# Altium project Strain gauge node.PrjPcb
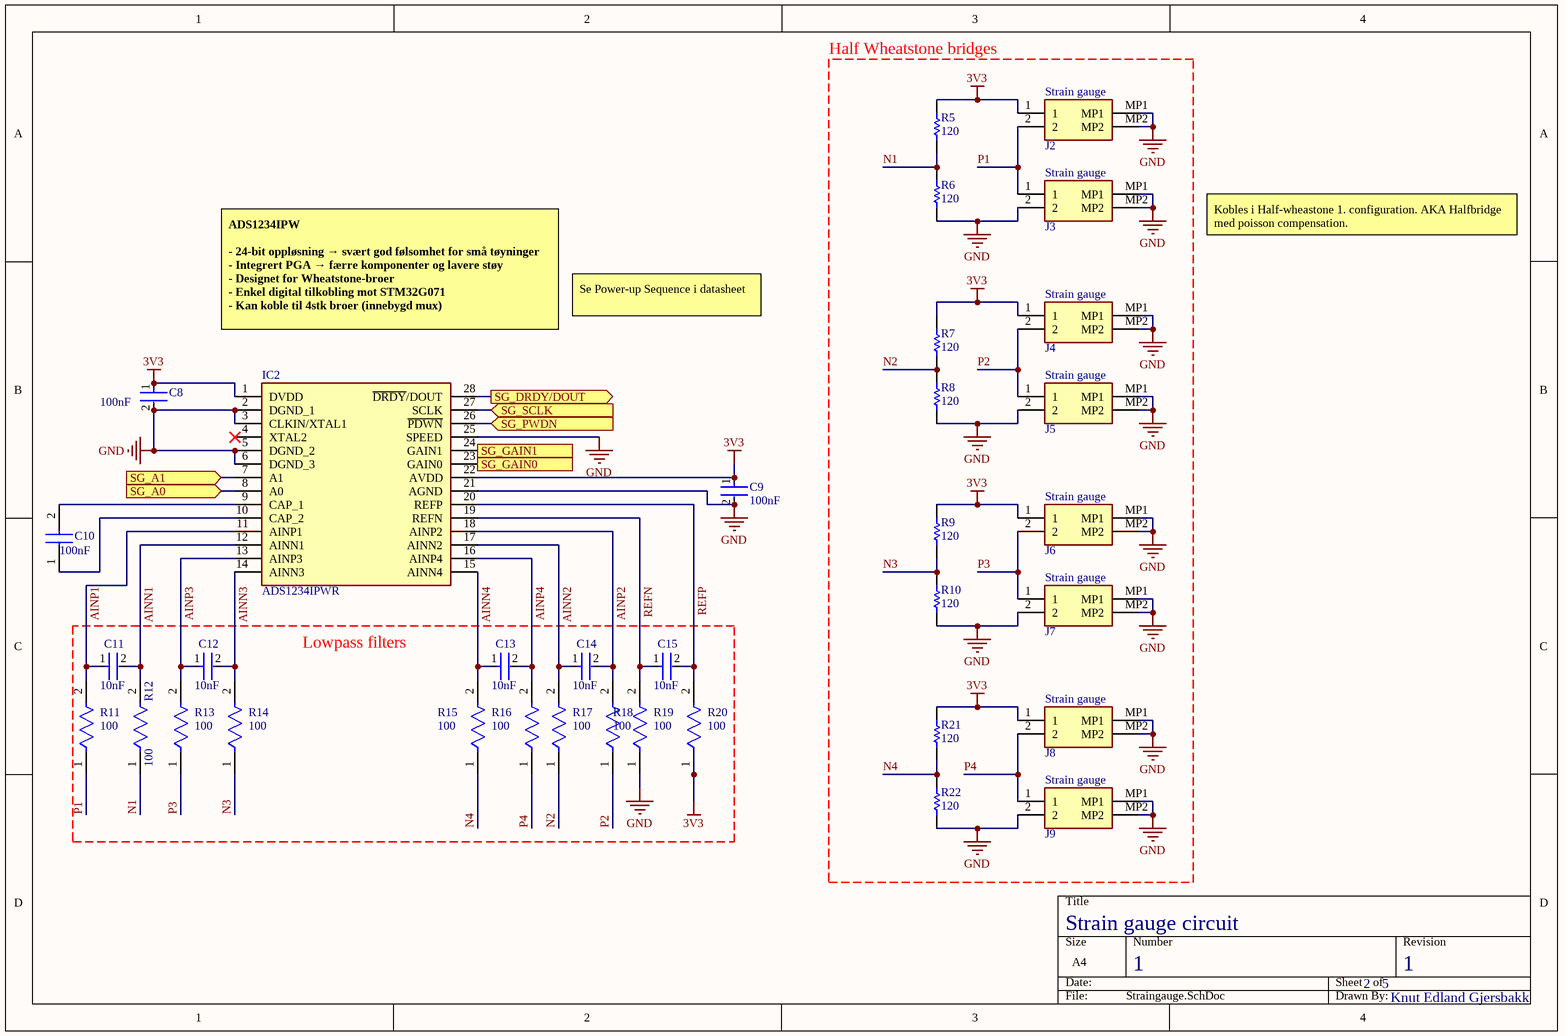
[diagram p0: Straingauge.SchDoc]
2 sheets, 52 parts. Net scope: flat (ports and power ports of the same name join across sheets).
Board file: StrainNode.PcbDoc
Sheets:
  Straingauge.SchDoc
  PowerV3.SchDoc

## Sheet Straingauge.SchDoc
size A4; SheetNumber: 2; SheetTotal: 5

### Parts
C8  100nF  [FP-CL10-IPC_C]
C9  100nF  [FP-CL10-IPC_C]
C10  100nF  [CAPC3216X180N]
C11  Capacitance: 10nF  [FP-GRM219-0_1-IPC_B]  (hidden comment: GRM2195C1H103JA01D)
C12  Capacitance: 10nF  [FP-GRM219-0_1-IPC_B]  (hidden comment: GRM2195C1H103JA01D)
C13  Capacitance: 10nF  [FP-GRM219-0_1-IPC_B]  (hidden comment: GRM2195C1H103JA01D)
C14  Capacitance: 10nF  [FP-GRM219-0_1-IPC_B]  (hidden comment: GRM2195C1H103JA01D)
C15  Capacitance: 10nF  [FP-GRM219-0_1-IPC_B]  (hidden comment: GRM2195C1H103JA01D)
IC2  ADS1234IPWR  [SOP65P640X120-28N]
J2  S2B-PH-SM4-TB_LF__SN_  [S2BPHSM4TBLFSN]  (value not drawn)
J3  S2B-PH-SM4-TB_LF__SN_  [S2BPHSM4TBLFSN]  (value not drawn)
J4  S2B-PH-SM4-TB_LF__SN_  [S2BPHSM4TBLFSN]  (value not drawn)
J5  S2B-PH-SM4-TB_LF__SN_  [S2BPHSM4TBLFSN]  (value not drawn)
J6  S2B-PH-SM4-TB_LF__SN_  [S2BPHSM4TBLFSN]  (value not drawn)
J7  S2B-PH-SM4-TB_LF__SN_  [S2BPHSM4TBLFSN]  (value not drawn)
J8  S2B-PH-SM4-TB_LF__SN_  [S2BPHSM4TBLFSN]  (value not drawn)
J9  S2B-PH-SM4-TB_LF__SN_  [S2BPHSM4TBLFSN]  (value not drawn)
R5  120  [RESC2013X60X40ML20T25]
R6  120  [RESC2013X60X40ML20T25]
R7  120  [RESC2013X60X40ML20T25]
R8  120  [RESC2013X60X40ML20T25]
R9  120  [RESC2013X60X40ML20T25]
R10  120  [RESC2013X60X40ML20T25]
R11  100  [FP-ERA3A-IPC_B]
R12  100  [FP-ERA3A-IPC_B]
R13  100  [FP-ERA3A-IPC_B]
R14  100  [FP-ERA3A-IPC_B]
R15  100  [FP-ERA3A-IPC_B]
R16  100  [FP-ERA3A-IPC_B]
R17  100  [FP-ERA3A-IPC_B]
R18  100  [FP-ERA3A-IPC_B]
R19  100  [FP-ERA3A-IPC_B]
R20  100  [FP-ERA3A-IPC_B]
R21  120  [RESC2013X60X40ML20T25]
R22  120  [RESC2013X60X40ML20T25]

### Blocks framed on the sheet
Half Wheatstone bridges: J2-J9 R5-R10 R21 R22
Lowpass filters: C11-C15 R11-R20

### Ports
SG_A0 (in, see Toplevel[3B]), SG_A1 (in, see Toplevel[3B]), SG_DRDY/DOUT (out, see Toplevel[3B]), SG_GAIN0 (in, see Toplevel[2B]), SG_GAIN1 (in, see Toplevel[2B]), SG_PWDN (in, see Toplevel[2B]), SG_SCLK (in, see Toplevel[2B])

### Nets
3V3: C8.1 C9.1 IC2.1(DVDD) IC2.22(AVDD) J2.1 J4.1 J6.1 J8.1 R5.2 R7.2 R9.2 R20.1 R21.2
GND: C8.2 C9.2 IC2.2(DGND_1) IC2.3(CLKIN/XTAL1) IC2.5(DGND_2) IC2.6(DGND_3) IC2.21(AGND) IC2.25(SPEED) J2.MP1 J2.MP2 J3.2 J3.MP1 J3.MP2 J4.MP1 J4.MP2 J5.2 J5.MP1 J5.MP2 J6.MP1 J6.MP2 J7.2 J7.MP1 J7.MP2 J8.MP1 J8.MP2 J9.2 J9.MP1 J9.MP2 R6.1 R8.1 R10.1 R19.1 R22.1
AINN1: C11.2 IC2.12(AINN1) R12.2
AINN2: C14.1 IC2.17(AINN2) R17.2
AINN3: C12.2 IC2.14(AINN3) R14.2
AINN4: C13.1 IC2.15(AINN4) R15.2
AINP1: C11.1 IC2.11(AINP1) R11.2
AINP2: C14.2 IC2.18(AINP2) R18.2
AINP3: C12.1 IC2.13(AINP3) R13.2
AINP4: C13.2 IC2.16(AINP4) R16.2
N1: R5.1 R6.2 R12.1
N2: R7.1 R8.2 R17.1
N3: R9.1 R10.2 R14.1
N4: R15.1 R21.1 R22.2
P1: J2.2 J3.1 R11.1
P2: J4.2 J5.1 R18.1
P3: J6.2 J7.1 R13.1
P4: J8.2 J9.1 R16.1
REFN: C15.1 IC2.19(REFN) R19.2
REFP: C15.2 IC2.20(REFP) R20.2
NetC10_1: C10.1 IC2.10(CAP_2)
NetC10_2: C10.2 IC2.9(CAP_1)
NetIC2_7: IC2.7(A1) ; port SG_A1
NetIC2_8: IC2.8(A0) ; port SG_A0
NetIC2_23: IC2.23(GAIN0) ; port SG_GAIN0
NetIC2_24: IC2.24(GAIN1) ; port SG_GAIN1
NetIC2_26: IC2.26(~{PDWN}) ; port SG_PWDN
NetIC2_27: IC2.27(SCLK) ; port SG_SCLK
NetIC2_28: IC2.28(~{DRDY}/DOUT) ; port SG_DRDY/DOUT

Not connected (* = marked no-connect by the designer): IC2 4(XTAL2)*

### Notes on the sheet
- (near J2) Strain gauge
- (near J3) Strain gauge
- Kobles i Half-wheastone 1. configuration. AKA Halfbridge med poisson compensation.
- Se Power-up Sequence i datasheet
- (near J4) Strain gauge
- ADS1234IPW
  - 24-bit oppløsning → svært god følsomhet for små tøyninger
  - Integrert PGA → færre komponenter og lavere støy
  - Designet for Wheatstone-broer
  - Enkel digital tilkobling mot STM32G071
  - Kan koble til 4stk broer (innebygd mux)
  Gain bør settes til 64 for Half bridge
- (near J5) Strain gauge
- (near J6) Strain gauge
- (near J7) Strain gauge
- (near J8) Strain gauge
- (near J9) Strain gauge
- Strain gauge circuit
- 1
- 2
- 5
- Knut Edland Gjersbakk

### Library data of the parts
C8 C9 = CMP-13271-002683-1: Cap Ceramic 100nF 16V X7R ±10% Pad SMD 0603 +125°C T/R / CL10B104KO8WPNC; Voltage Rating: 16V; Max Operating Temperature: 125°C; Capacitance: 100nF; Features: Soft Termination; Length: 0.063inch; Packaging: Tape and Reel; Min Operating Temperature: -55°C; Mount: Surface Mount; Case/Package: 0603; Case Code (Metric): 1608; Width: 0.031inch; Ratings: AEC-Q200; Thickness: 0.035inch; Case Code (Imperial): 0603; Tolerance: 10%
C10 = GRM31C5C1E104JA01L: Capacitor; Manufacturer_Name: Murata Electronics; Datasheet Link: https://search.murata.co.jp/Ceramy/image/img/A01X/G101/ENG/GRM31C5C1E104JA01-01A.pdf; Height: 1.8mm; Manufacturer_Part_Number: GRM31C5C1E104JA01L; Mouser Part Number: 81-GRM31C5C1E104JA01; Mouser Price/Stock: https://www.mouser.co.uk/ProductDetail/Murata-Electronics/GRM31C5C1E104JA01L?qs=Iy3qAC6%2FTQjjy5bmw5NuQw%3D%3D; Arrow Part Number: GRM31C5C1E104JA01L; Arrow Price/Stock: https://www.arrow.com/en/products/grm31c5c1e104ja01l/murata-manufacturing?region=nac; Supplier 1: Avnet; Supplier Part Number 1: GRM31C5C1E104JA01L
C11-C15 = CMP-2007-00135-2: Chip Multilayer Ceramic Capacitors for General Purpose, 0805, 10000pF, C0G, 30ppm/°C, 5%, 50V; Insulation Resistance: 10GR; Max Operating Temperature: 125°C; Height: 0.85mm; Voltage: 50V; Dielectric Material: Ceramic; Voltage Rating: 50V; Dielectric: C0G; Thickness: 0.037inch; REACH SVHC: No SVHC; Lead Free: Lead Free; Depth: 1.25mm; Min Operating Temperature: -55°C; Package Quantity: 1; Packaging: Tape and Reel; Case Code (Imperial): 0805; Case/Package: 0805; Mount: Surface Mount; Width: 0.049inch; Case Code (Metric): 2012; Length: 2mm; Termination: SMD/SMT; Material: Ceramic; Tolerance: 5%; Temperature Coefficient: 30ppm/°C; Number of Pins: 2; Voltage Rating (DC): 50V; Radiation Hardening: No
IC2 = ADS1234IPWR: Integrated Circuit; Manufacturer_Name: Texas Instruments; Datasheet Link: http://www.ti.com/lit/gpn/ADS1234; Height: 1.2mm; Manufacturer_Part_Number: ADS1234IPWR; Mouser Part Number: 595-ADS1234IPWR; Mouser Price/Stock: https://www.mouser.co.uk/ProductDetail/Texas-Instruments/ADS1234IPWR?qs=RaXRGs7zCv7Rr7lBA3sshA%3D%3D; Arrow Part Number: ADS1234IPWR; Arrow Price/Stock: https://www.arrow.com/en/products/ads1234ipwr/texas-instruments
J2-J9 = S2B-PH-SM4-TB_LF__SN_: Connector; Manufacturer_Name: JST (JAPAN SOLDERLESS TERMINALS); Manufacturer_Part_Number: S2B-PH-SM4-TB(LF)(SN); Datasheet Link: https://www.jst-mfg.com/product/pdf/eng/ePH.pdf; Height: 6.6mm; Mouser Part Number: N/A; Mouser Price/Stock: https://www.mouser.co.uk/ProductDetail/JST-Commercial/S2B-PH-SM4-TBLFSN?qs=QpmGXVUTftEA9IU90i0xlg%3D%3D; Arrow Part Number: S2B-PH-SM4-TB(LF)(SN); Arrow Price/Stock: https://www.arrow.com/en/products/s2b-ph-sm4-tb-lf-sn/jst-manufacturing?utm_currency=USD&region=europe
R5-R10 R21 R22 = CMP-2001-00588-1: Manufacturer: Panasonic; Part Number: ERA6AEB121V
R11-R20 = CMP-2000-00870-2: RES SMD 100 OHM 0.1% 1/10W 0603; Voltage Rating: 75V; Power Rating: 100mW; Resistance: 100R; Temperature Coefficient: 25ppm/°C; Number of Terminations: 2; Case/Package: 0603; Termination: SMD/SMT; Number of Pins: 2; Size Code: 0603; Length: 1.6mm; Min Operating Temperature: -55°C; Resistor Type: Thin Film; Depth: 0.8mm; Military Standard: Not; Packaging: Tape and Reel; RoHS Compliant: Yes; Construction: Rectangular; Resistance Tolerance: 0.1%; Contact Plating: Tin; Width: 0.8mm; Mount: Surface Mount; Case Code (Metric): 1608; Max Operating Temperature: 155°C; Height: 0.45mm; Case Code (Imperial): 0603; Series: ERA-3A; Package Quantity: 5000; REACH SVHC: No SVHC; Tolerance: 0.1%; Max Power Dissipation: 100mW; Radiation Hardening: No; Technology: METAL FILM

## Sheet PowerV3.SchDoc
size A3; SheetNumber: 4; SheetTotal: 5
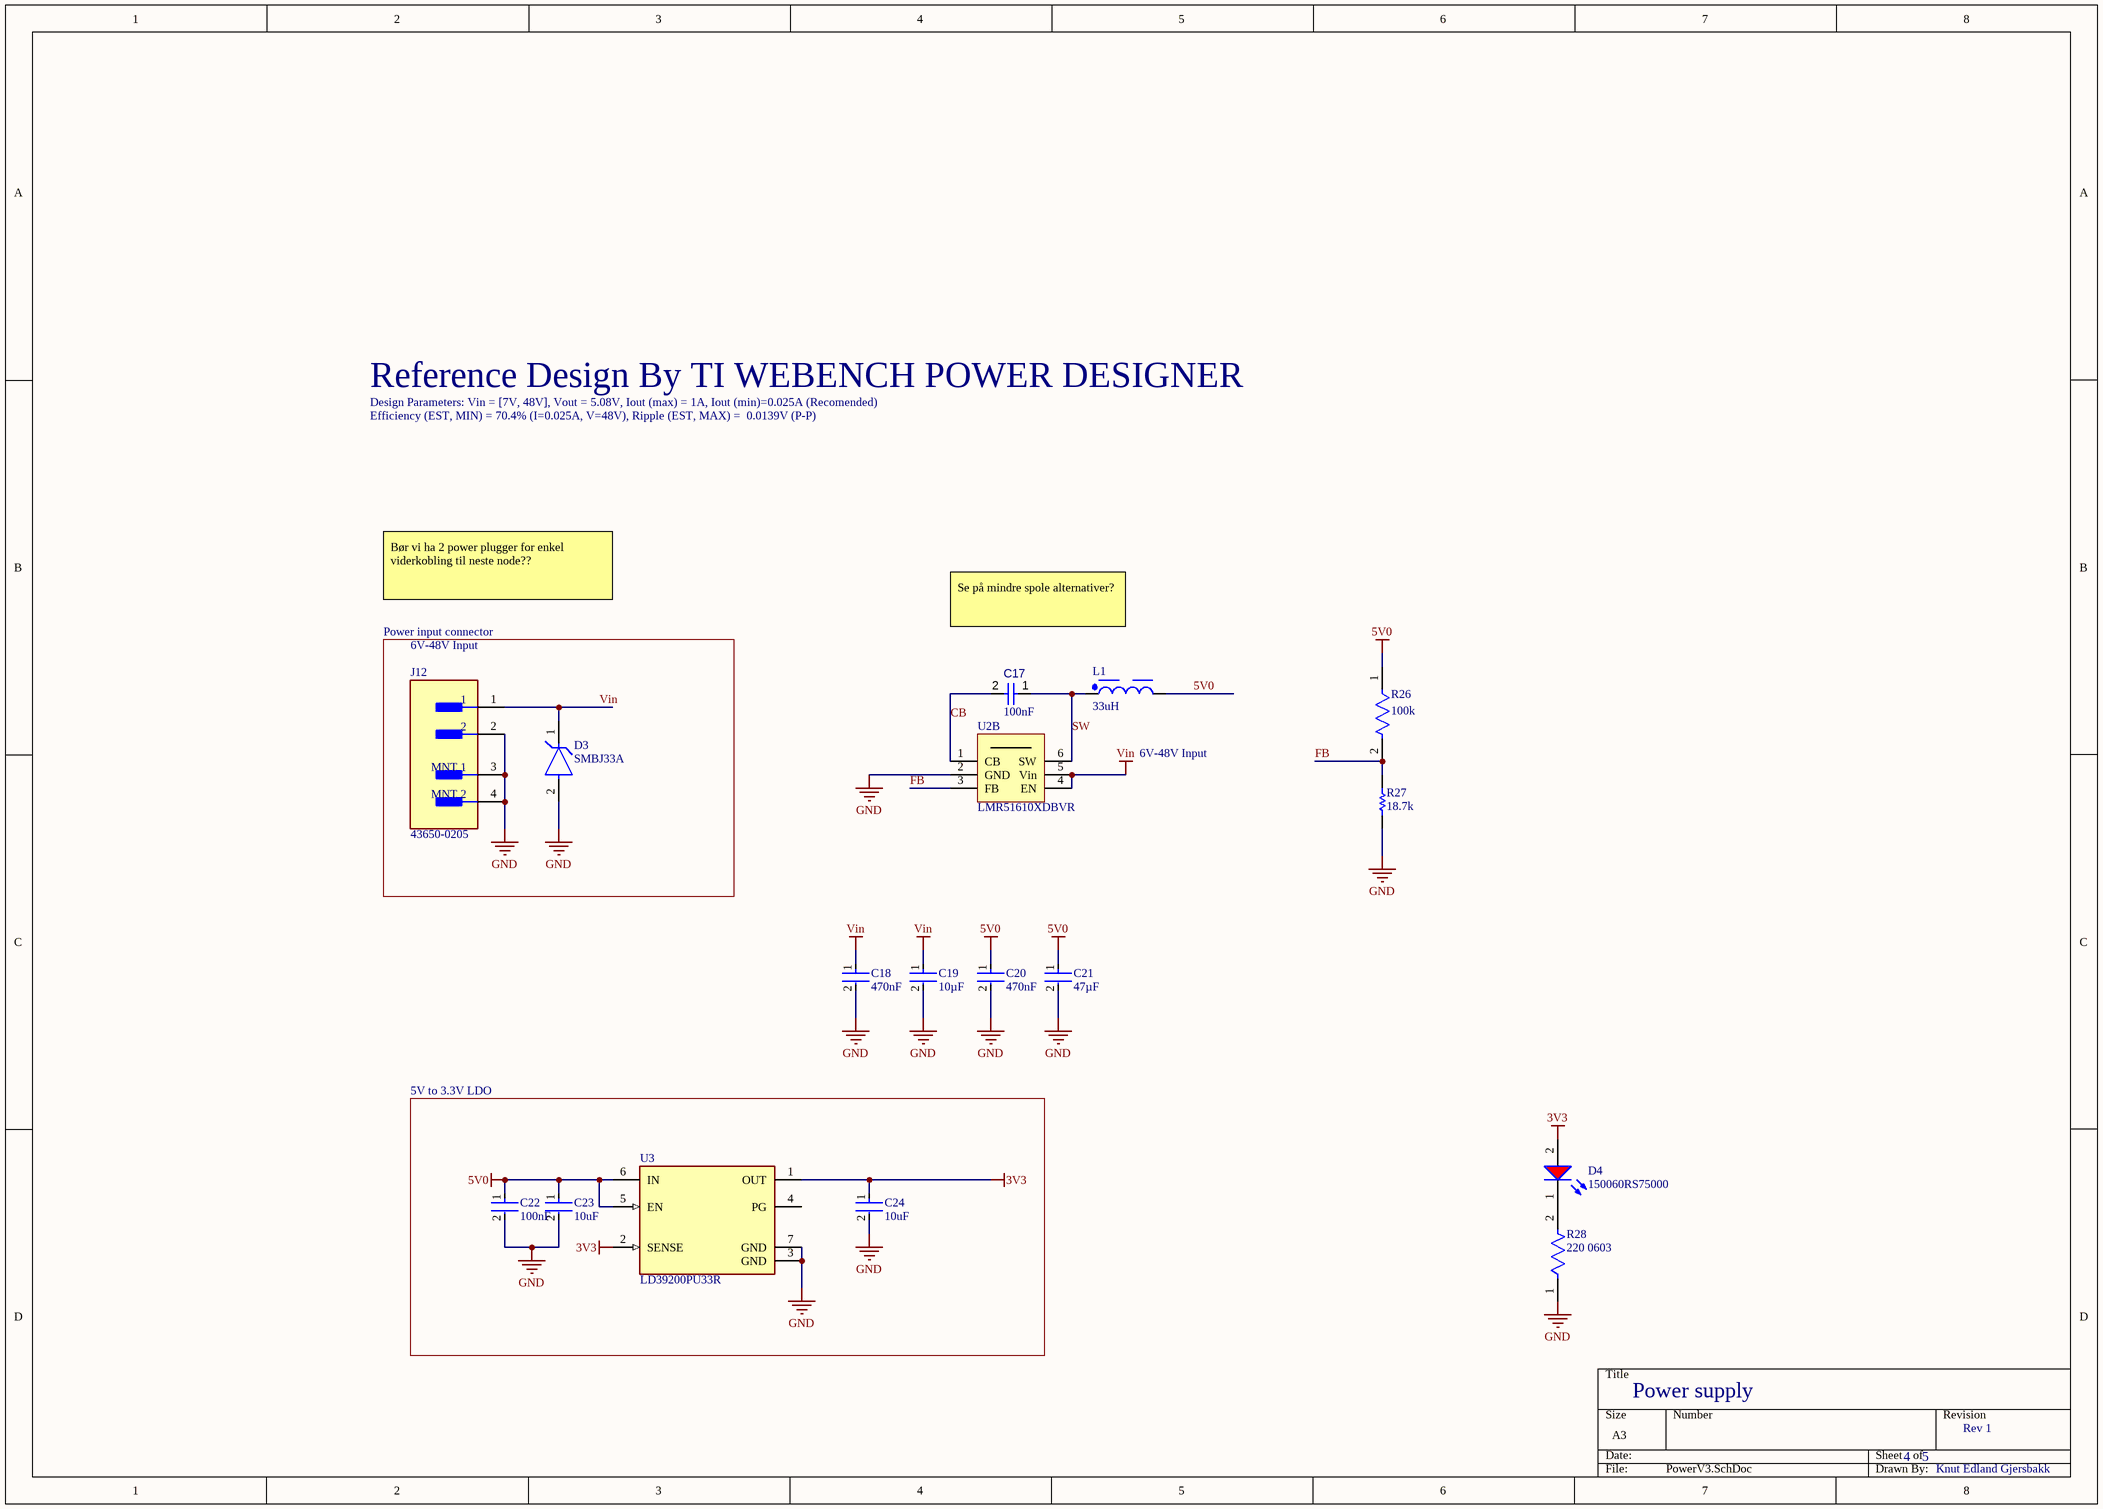
[diagram p1: PowerV3.SchDoc]

### Parts
C17  value 100nF  [CAPC2013X95X50LL10T25]  (hidden comment: Capacitor 100 nF +/-10% 50 V 0805)
C18  value 470nF  [FP-CL21-IPC_A]  (hidden comment: CL21B474KBFNNNF)
C19  value 10µF  [FP-CL31B106KBHNNNE-IPC_A]  (hidden comment: CL31B106KBHNNNE)
C20  value 470nF  [FP-CL21-IPC_A]  (hidden comment: CL21B474KBFNNNF)
C21  value 47µF  [FP-GRM31C-0_2-e0_3_0_8-IPC_B]  (hidden comment: GRM31CR61A476KE15K)
C22  100nF  [FP-CL10-IPC_C]
C23  10uF  [FP-CL10-IPC_C]
C24  10uF  [FP-CL10-IPC_C]
D3  SMBJ33A  [FP-SMBJ-MFG]
D4  150060RS75000  [WL-SMCW_0603_150060xx75000]
J12  43650-0205  [FP-43650-0205-MFG]
L1  value 33uH  [WE-PD_1260P]  (hidden comment: 7447706330)
R26  value 100k  [FP-CRGCQ1206-IPC_A]  (hidden comment: CRGCQ1206F100K)
R27  value 18.7k  [RESC2013X60X40LL20T25]  (hidden comment: ERA-6AEB1872V)
R28  220 0603  [FP-AF0603-IPC_C]
U2  LMR51610XDBVR  [SOT95P280X145-6N]  (part B of 2)
U3  LD39200PU33R  [FP-DFN6-7946637-MFG]

### Blocks framed on the sheet
5V to 3.3V LDO: C22-C24 U3

### Nets
3V3: C24.1 D4.2(A) U3.1(OUT) U3.2(SENSE)
5V0: C20.1 C21.1 C22.1 C23.1 L1.2 R26.1 U3.5(EN) U3.6(IN)
GND: C18.2 C19.2 C20.2 C21.2 C22.2 C23.2 C24.2 D3.2(A) J12.2 J12.3(MNT_1) J12.4(MNT_2) R27.2 R28.1 U2.2(GND) U3.3(GND) U3.7(GND)
Vin: C18.1 C19.1 D3.1(C) J12.1 U2.4(EN) U2.5(Vin)
CB: C17.2 U2.1(CB)
FB: R26.2 R27.1 U2.3(FB)
SW: C17.1 L1.1 U2.6(SW)
NetD4_1: D4.1(K) R28.2

Not connected (* = marked no-connect by the designer): U3 4(PG)

### Notes on the sheet
- Reference Design By TI WEBENCH POWER DESIGNER
- Design Parameters: Vin = [7V, 48V], Vout = 5.08V, Iout (max) = 1A, Iout (min)=0.025A (Recomended)
- Efficiency (EST, MIN) = 70.4% (I=0.025A, V=48V), Ripple (EST, MAX) =  0.0139V (P-P)
- Power input connector
- Bør vi ha 2 power plugger for enkel viderkobling til neste node??
- 6V-48V Input
- Se på mindre spole alternativer?
- Power supply
- 4
- 5
- Rev 1
- Knut Edland Gjersbakk

### Library data of the parts
C17 = CMP-001-00018-6: Chip Capacitor, 100 nF, +/- 10%, 50 V, 0805 (2012 Metric); Capacitor Type: Ceramic; Voltage Rating: 50V; Pins: 2; Max Operating Temperature: 125°C; Min Operating Temperature: -55°C; Mounting Technology: SM; Case/Package: 0805; RoHS Compliant: True; Tolerance: 10%
C18 C20 = CMP-001-00098-1: Ceramic Capacitor, Multilayer, Ceramic, 50V, 10% +Tol, 10% -Tol, X7R, 15% TC, 0.47uF, Surface Mount, 0805; Multilayer: Yes; Mounting Technology: Surface Mount; Tolerance (fill in as +-): 10%; Max Operating Temperature: 125°C; Tolerance  (fill in as +-): 10%; Termination: Wraparound; Dielectric Material: Ceramic; Min Operating Temperature: -55°C; Length: 2mm; Terminal Finish: Nickel; Temperature Characteristics Code: X7R; Package Shape: Rectangular; Packaging: Tape and Reel; Pins: 2; Rated DC Voltage (URdc): 50V; Capacitor Type: Ceramic; Width: 1.25mm; JESD-609 Code: e3; Package Style: SMTMeter; Case/Package: 0805; Height: 1.25mm; RoHS Compliant: Yes; Reach SVHC Compliant: Yes
C19 = CMP-001-00099-1: Ceramic Capacitor, Multilayer, Ceramic, 50V, 10% +Tol, 10% -Tol, X7R, 15% TC, 10uF, Surface Mount, 1206; Multilayer: Yes; Dielectric Material: Ceramic; Tolerance (fill in as +-): 10%; Temperature Characteristics Code: X7R; Pins: 2; Termination: Wraparound; Width: 1.6mm; Max Operating Temperature: 125°C; Reach SVHC Compliant: Yes; Package Shape: Rectangular; Min Operating Temperature: -55°C; Length: 3.2mm; Mounting Technology: Surface Mount; Package Style: SMTMeter; Height: 1.8mm; Terminal Finish: Nickel; RoHS Compliant: Yes; Tolerance  (fill in as +-): 10%; JESD-609 Code: e3; Case/Package: 1206; Packaging: Tape and Reel; Capacitor Type: Ceramic; Rated DC Voltage (URdc): 50V
C21 = CMP-001-00103-1: Ceramic Capacitor, Multilayer, Ceramic, 10V, 10% +Tol, 10% -Tol, X5R, 15% TC, 47uF, Surface Mount, 1206; Multilayer: Yes; Max Operating Temperature: 85°C; Case/Package: 1206; JESD-609 Code: e3; Pins: 2; Capacitor Type: Ceramic; Dielectric Material: Ceramic; Packaging: Tape and Reel; Width: 1.6mm; Tolerance  (fill in as +-): 10%; Temperature Characteristics Code: X5R; Package Style: SMTMeter; Reach SVHC Compliant: Yes; Terminal Finish: Nickel; Package Shape: Rectangular; Height: 1.6mm; Termination: Wraparound; Tolerance (fill in as +-): 10%; Length: 3.2mm; Rated DC Voltage (URdc): 10V; Min Operating Temperature: -55°C; RoHS Compliant: Yes; Mounting Technology: Surface Mount
C22 = CMP-13271-002683-1: as C8 on sheet Straingauge; Voltage Rating: 16V; Max Operating Temperature: 125°C; Capacitance: 100nF; Features: Soft Termination; Length: 0.063inch; Packaging: Tape and Reel; Min Operating Temperature: -55°C; Mount: Surface Mount; Case/Package: 0603; Case Code (Metric): 1608; Width: 0.031inch; Ratings: AEC-Q200; Thickness: 0.035inch; Case Code (Imperial): 0603; Tolerance: 10%
C23 C24 = CMP-13271-003287-1: Cap Ceramic 10uF 16V X6S ±20% Pad SMD 0603 +105°C T/R / CL10X106MO8NRNC; Thickness: 0.035inch; Mount: Surface Mount; Length: 0.063inch; Voltage Rating: 16V; Case Code (Imperial): 0603; Case/Package: 0603; Max Operating Temperature: 105°C; Tolerance: 20%; Case Code (Metric): 1608; Width: 0.031inch; Capacitance: 10uF; Min Operating Temperature: -55°C; Packaging: Tape and Reel
D3 = CMP-2000-07095-2: TVS DIODE 33V 53.3V DO214AA; Manufacturer: Littelfuse Inc; Max Junction Temp: +150°C; Number Of Channels: 1; Breakdown Voltage: 36.7V; Peak Pulse Power: 600W; Direction: Unidirectional; Peak Pulse Current: 11.3A; Lead Free: Yes; Height: 2.61mm; Temperature Range Low: -65°C; ComponentLink2URL: https://www.littelfuse.com/~/media/electronics/datasheets/tvs_diodes/littelfuse_tvs_diode_smbj_datasheet.pdf.pdf; Manufacturer Part Number: SMBJ33A; Clamping Voltage: 53.3V; Device Class L1: Circuit Protection; Octopart: https://octopart.com/smbj33a-littelfuse-350829; Device Class L2: TVS Diodes; Digikey Description: TVS DIODE 33V 53.3V DO214AA; Automotive: No; Temperature Range High: +150°C; Package: SMBJ; ComponentLink2Description: Datasheet; Mouser Description: TVS DIODE 33V 53.3V DO214AA; Reverse Standoff Voltage: 33V; Category: Diode; Device Class L3: unset; Temperature: -65°C to +150°C; RoHS: TRUE
D4 = CMP-1426-00001-4: LED Low-Power Uni-Color Red 630nm 2V 2-Pin Chip 0603(1608Metric) T/R; Max Junction Temperature (Tj): 95°C; Dominant Wavelength: 625nm; Lens Style: Clear, Rectangular; Viewing Angle: 140°; Forward Current: 100mA; Max Reverse Voltage (DC): 5V; Luminous Intensity: 250mcd; Test Current: 20mA; Power Dissipation: 72mW; Max Operating Temperature: 85°C; Mount: Surface Mount; Height: 700µm; Packaging: Tape and Reel; REACH SVHC: Unknown; Case Code (Metric): 1608; Peak Wavelength: 630nm; Forward Voltage: 2V; Case/Package: 0603; Color: Red; RoHS: Compliant; Width: 800µm; Reverse Voltage: 5V; Min Operating Temperature: -40°C; Wavelength: 625nm; Case Code (Imperial): 0603; Length: 1.6mm
J12 = CMP-00257-07672643-1: 43650-0205 Conn Wire to Board HDR 2 POS 3mm Solder RA Side Entry Thru-Hole Micro-Fit 3.0™ Tray; Manufacturer Lifecycle Status: ACTIVE; Plating: Tin; Glow Wire Compliant: Compliant; Number of Contacts: 2; Gender: Male; Voltage Rating: 600V; Current Rating: 5A; Lifecycle Status: Production; RoHS: Compliant; Number of Rows: 1; Housing Material: Thermoplastic; Country of Origin: US; Number of Circuits: 2; Halogen Free: Low Halogen; Orientation: Right Angle; Termination: Through Hole; Pitch: 3mm; Contact Material: Brass; Contact Plating: Gold; NexarPartId: 7672643; Number of Positions: 2
L1 = CMP-006-00028-1: General Purpose Inductor; RoHS Compliant: Yes
R26 = CMP-009-00192-1: Fixed Resistor, Metal Glaze/thick Film, 0.25W, 100000ohm, 200V, 1% +/-Tol, 100ppm/Cel, Surface Mount, 1206; Reach SVHC Compliant: Yes; Pins: 2; Resistor Type: FIXED RESISTOR; RoHS Compliant: Yes
R27 = CMP-009-00195-1: Fixed Resistor, Thin Film, 0.125W, 18700ohm, 100V, 0.1% +/-Tol, 25ppm/Cel, Surface Mount, 0805; Rated Temperature: 85°C; Temperature Coefficient (ppm/Cel): 25; Reference Standard: AEC-Q200; Package Width: 1.25mm; Package Length: 2mm; Package Height: 0.5mm; Power: 125mW; Reach SVHC Compliant: Yes; Pins: 2; Technology: THIN FILM; Working Voltage: 100V; Packaging: Tape and Reel; Construction: Rectangular; JESD-609 Code: e3; Termination: Wraparound; RoHS Compliant: Yes; Case/Package: 0805; Min Operating Temperature: -55°C; Tolerance: 0.1%; Mounting Technology: Surface Mount; Resistor Type: FIXED RESISTOR; Terminal Finish: Nickel; Max Operating Temperature: 155°C
R28 = CMP-03412-038529-1: AF0603JR-07220RL Anti-Sulfurated Chip Resistors Automotive Grade 220Ω 5% 100ppm/°C 0603; Max Power Dissipation: 100mW; Resistance: 220R; Width: 0.031inch; Case/Package: 0603; Series: AF; Features: Moisture Resistant; Tolerance: 5%; Resistor Type: Thick Film; Max Operating Temperature: 155°C; Length: 0.063inch; RoHS Compliant: Yes; Lead Free: Lead Free; Packaging: Tape and Reel; Number of Terminations: 2; Temperature Coefficient: 100ppm/°C; Height: 0.022inch; Min Operating Temperature: -55°C
U2 = CMP-019-00059-1: SIMPLE SWITCHER® 4.5-V to 65-V, 1-A synchronous buck converter with 25-µA IQ 6-SOT-23 -40 to 150; Max Supply Voltage: 65V; Min Supply Voltage: 4.5V; Output Current: 1A; Frequency: 400Hz; Pins: 6; Case/Package: SOT-23
U3 = CMP-12153-000011-1: IC REG LINEAR 3.3V 2A 6DFN; Number of Outputs: 1; Max Input Voltage: 6V; Output Type: Fixed; Min Input Voltage: 1.25V; Dropout Voltage: 130mV; Operating Supply Current: 1mA; Number of Regulators: 1; Case/Package: DFN; Packaging: Tape and Reel; Output Current: 2A; Min Operating Temperature: -40°C; Mount: Surface Mount; Output Voltage: 3.3V; Max Operating Temperature: 125°C; Lead Free: Lead Free; Package Quantity: 3000

## Nets that join several sheets
3V3: Straingauge (13 pins), PowerV3 (C24.1 D4.2 U3.1 U3.2)
GND: Straingauge (33 pins), PowerV3 (16 pins)